# EAGLE design UI (EAGLE 9.6.2)

## Sheet 1 of 2
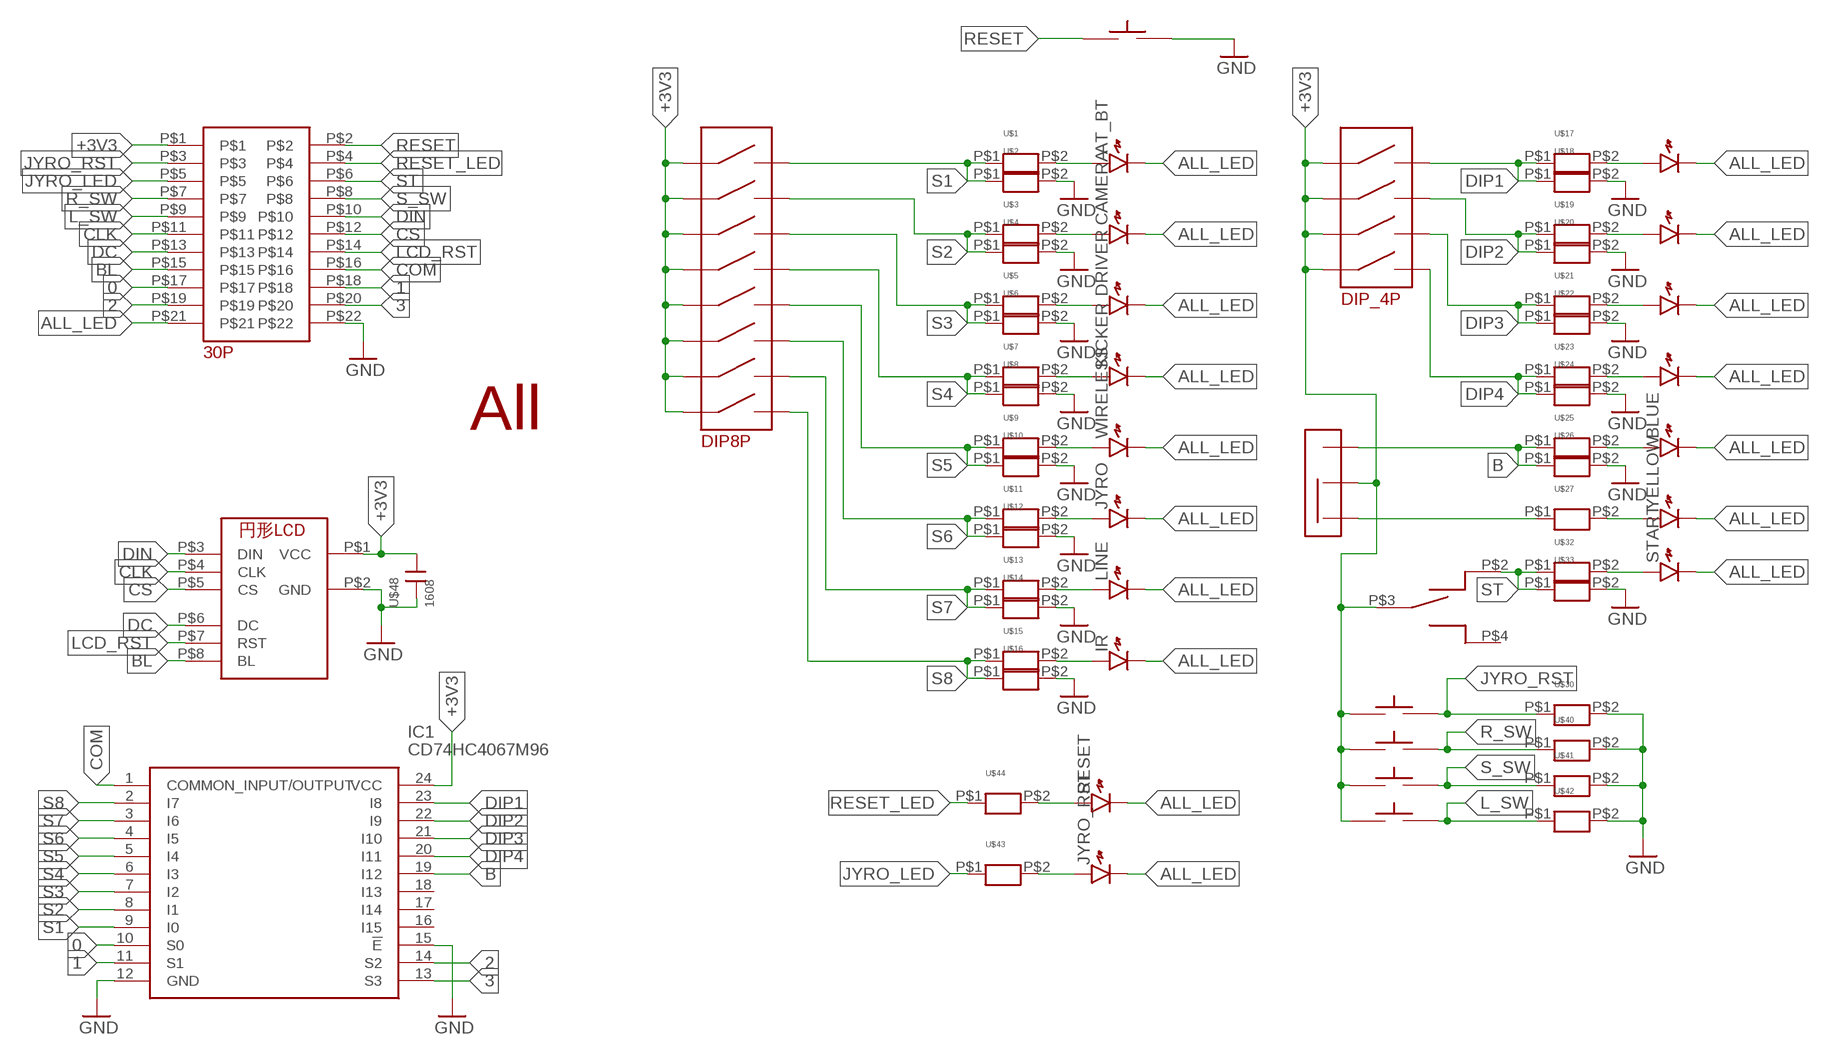
[diagram p0: schematic, sheet 1]

### Parts
AT_BT  LED1608  [LED1608]
BLUE  LED1608  [LED1608]
CAMERA  LED1608  [LED1608]
DRIVER  LED1608  [LED1608]
IC1  CD74HC4067M96  [SOIC127P1030X265-24N]
IR  LED1608  [LED1608]
JYRO  LED1608  [LED1608]
JYRO_RST  LED1608  [LED1608]
KICKER  LED1608  [LED1608]
LINE  LED1608  [LED1608]
RESET  LED1608  [LED1608]
START  LED1608  [LED1608]
U$1  R  [1608]
U$2  R  [1608]
U$3  R  [1608]
U$4  R  [1608]
U$5  R  [1608]
U$6  R  [1608]
U$7  R  [1608]
U$8  R  [1608]
U$9  R  [1608]
U$10  R  [1608]
U$11  R  [1608]
U$12  R  [1608]
U$13  R  [1608]
U$14  R  [1608]
U$15  R  [1608]
U$16  R  [1608]
U$17  R  [1608]
U$18  R  [1608]
U$19  R  [1608]
U$20  R  [1608]
U$21  R  [1608]
U$22  R  [1608]
U$23  R  [1608]
U$24  R  [1608]
U$25  R  [1608]
U$26  R  [1608]
U$27  R  [1608]
U$28  DIPSW4  [DIPSW4]
U$29  TAKUTO  [12]
U$30  R  [1608]
U$31  S  [S]
U$32  R  [1608]
U$33  R  [1608]
U$34  TAKUTO  [12]
U$35  SSW  [SSW]
U$36  DIPSW8  [DIPSW8]
U$37  TAKUTO  [12]
U$38  TAKUTO  [12]
U$39  TAKUTO  [12]
U$40  R  [1608]
U$41  R  [1608]
U$42  R  [1608]
U$43  R  [1608]
U$44  R  [1608]
U$45  LPRP  [LPRO]
U$46  LCDEN  [LCD]
U$48  1608  [CON]
U$49  ALL  [ALL]
WIRELESS  LED1608  [LED1608]
YELLOW  LED1608  [LED1608]
Ⅰ  LED1608  [LED1608]
Ⅱ  LED1608  [LED1608]
Ⅲ  LED1608  [LED1608]
Ⅳ  LED1608  [LED1608]

### Nets
0: IC1.10(S0) U$45.P$17
1: IC1.11(S1) U$45.P$18
2: IC1.14(S2) U$45.P$19
3: IC1.13(S3) U$45.P$20
+3V3: IC1.24(VCC) U$28.P$1 U$28.P$2 U$28.P$3 U$28.P$4 U$31.P$3 U$34.P$1 U$34.P$2 U$35.P$3 U$36.P$1 U$36.P$2 U$36.P$3 U$36.P$4 U$36.P$5 U$36.P$6 U$36.P$7 U$36.P$8 U$37.P$1 U$37.P$2 U$38.P$1 U$38.P$2 U$39.P$1 U$39.P$2 U$45.P$1 U$46.P$1(VCC) U$48.P$1
ALL_LED: AT_BT.K BLUE.K CAMERA.K DRIVER.K IR.K JYRO.K JYRO_RST.K KICKER.K LINE.K RESET.K START.K U$45.P$21 WIRELESS.K YELLOW.K Ⅰ.K Ⅱ.K Ⅲ.K Ⅳ.K
B: IC1.19(I12) U$25.P$1 U$26.P$1 U$35.P$2
BL: U$45.P$15 U$46.P$8(BL)
CLK: U$45.P$11 U$46.P$4(CLK)
COM: IC1.1(COMMON_INPUT/OUTPUT) U$45.P$16
CS: U$45.P$12 U$46.P$5(CS)
DC: U$45.P$13 U$46.P$6(DC)
DIN: U$45.P$10 U$46.P$3(DIN)
DIP1: IC1.23(I8) U$17.P$1 U$18.P$1 U$28.P$8
DIP2: IC1.22(I9) U$19.P$1 U$20.P$1 U$28.P$7
DIP3: IC1.21(I10) U$21.P$1 U$22.P$1 U$28.P$6
DIP4: IC1.20(I11) U$23.P$1 U$24.P$1 U$28.P$5
GND: IC1.12(GND) IC1.15(!E) U$2.P$2 U$4.P$2 U$6.P$2 U$8.P$2 U$10.P$2 U$12.P$2 U$14.P$2 U$16.P$2 U$18.P$2 U$20.P$2 U$22.P$2 U$24.P$2 U$26.P$2 U$29.P$3 U$29.P$4 U$30.P$2 U$33.P$2 U$40.P$2 U$41.P$2 U$42.P$2 U$45.P$22 U$46.P$2(GND) U$48.P$2
JYRO_LED: U$43.P$1 U$45.P$5
JYRO_RST: U$30.P$1 U$34.P$3 U$34.P$4 U$45.P$3
L_SW: U$39.P$3 U$39.P$4 U$42.P$1 U$45.P$9
LCD_RST: U$45.P$14 U$46.P$7(RST)
N$1: JYRO_RST.A U$43.P$2
N$2: START.A U$32.P$2
N$3: AT_BT.A U$1.P$2
N$4: CAMERA.A U$3.P$2
N$5: RESET.A U$44.P$2
N$6: DRIVER.A U$5.P$2
N$8: KICKER.A U$7.P$2
N$10: U$9.P$2 WIRELESS.A
N$12: JYRO.A U$11.P$2
N$14: LINE.A U$13.P$2
N$16: IR.A U$15.P$2
N$18: U$17.P$2 Ⅰ.A
N$20: U$19.P$2 Ⅱ.A
N$22: U$21.P$2 Ⅲ.A
N$24: U$23.P$2 Ⅳ.A
N$26: BLUE.A U$25.P$2
N$28: U$27.P$2 YELLOW.A
R_SW: U$37.P$3 U$37.P$4 U$40.P$1 U$45.P$7
RESET: U$29.P$1 U$29.P$2 U$45.P$2
RESET_LED: U$44.P$1 U$45.P$4
S1: IC1.9(I0) U$1.P$1 U$2.P$1 U$36.P$16
S2: IC1.8(I1) U$3.P$1 U$4.P$1 U$36.P$15
S3: IC1.7(I2) U$5.P$1 U$6.P$1 U$36.P$14
S4: IC1.6(I3) U$7.P$1 U$8.P$1 U$36.P$13
S5: IC1.5(I4) U$9.P$1 U$10.P$1 U$36.P$12
S6: IC1.4(I5) U$11.P$1 U$12.P$1 U$36.P$11
S7: IC1.3(I6) U$13.P$1 U$14.P$1 U$36.P$10
S8: IC1.2(I7) U$15.P$1 U$16.P$1 U$36.P$9
S_SW: U$38.P$3 U$38.P$4 U$41.P$1 U$45.P$8
ST: U$31.P$2 U$32.P$1 U$33.P$1 U$45.P$6
Y: U$27.P$1 U$35.P$1
Unconnected: IC1.16(I15) IC1.17(I14) IC1.18(I13) U$31.P$4

## Sheet 2 of 2
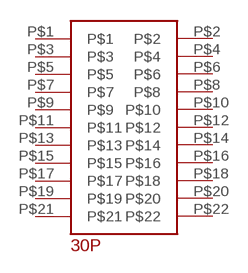
[diagram p1: schematic, sheet 2]

### Parts
U$47  LPRP  [LPRO]
Unconnected: U$47.P$1 U$47.P$2 U$47.P$3 U$47.P$4 U$47.P$5 U$47.P$6 U$47.P$7 U$47.P$8 U$47.P$9 U$47.P$10 U$47.P$11 U$47.P$12 U$47.P$13 U$47.P$14 U$47.P$15 U$47.P$16 U$47.P$17 U$47.P$18 U$47.P$19 U$47.P$20 U$47.P$21 U$47.P$22

## Library data of the parts
AT_BT BLUE CAMERA DRIVER IR JYRO JYRO_RST KICKER LINE RESET START WIRELESS YELLOW Ⅰ Ⅱ Ⅲ Ⅳ = generic:LED: Generic LEDs
IC1 = 16ch アナログマルチプレクサ:CD74HC4067M96: High Speed CMOS 16-Channel Analog Multiplexer/Demultiplexer Source: Datasheet <http://www.ti.com/lit/gpn/cd74hc4067>; DESCRIPTION: High Speed CMOS 16-Channel Analog Multiplexer/Demultiplexer; HEIGHT: 2.65mm; MANUFACTURER_NAME: Texas Instruments; MANUFACTURER_PART_NUMBER: CD74HC4067M96; MOUSER_PART_NUMBER: 595-CD74HC4067M96; MOUSER_PRICE-STOCK: https://www.mouser.co.uk/ProductDetail/Texas-Instruments/CD74HC4067M96?qs=xFfolx0DHx0XT7d9xTTZBA%3D%3D
U$1-U$27 U$30 U$32 U$33 U$40-U$44 = R 1608:R
U$28 = 4P_DIPSW:DIPSW4
U$29 U$34 U$37-U$39 = タクト:TAKUTO
U$31 = トグル:S
U$35 = SSW:SSW
U$36 = 8P_DIPSW:DIPSW8
U$45 U$47 = 22Ｐ　ロープロ:LPRP
U$46 = 円形LCD:LCDEN
U$48 = con1608:1608
U$49 = All_outlook:ALL

## Net classes
0 default: width 0.279 mm

## Board
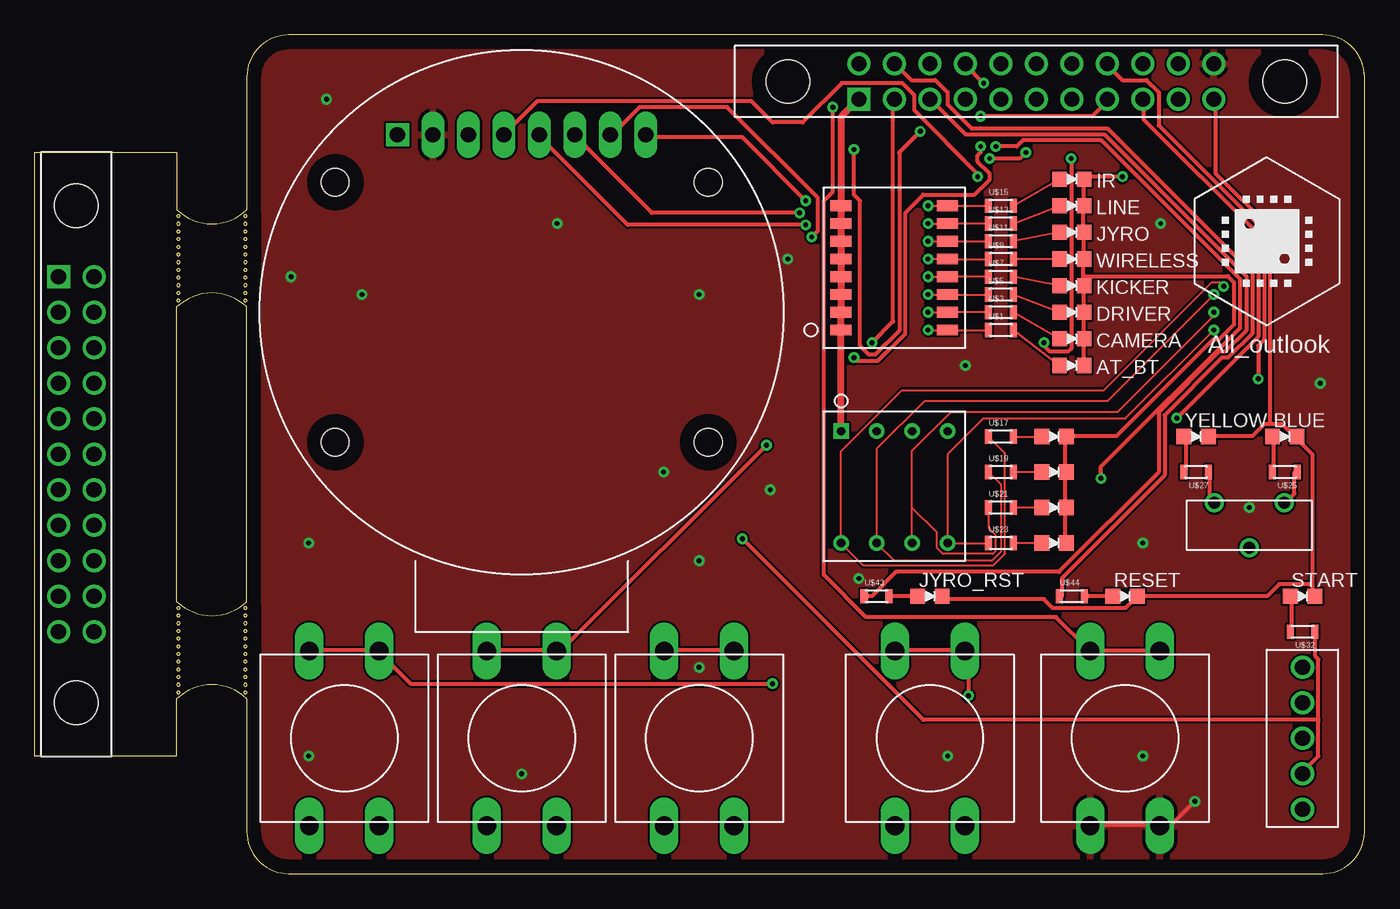
[diagram p2: board, top side]
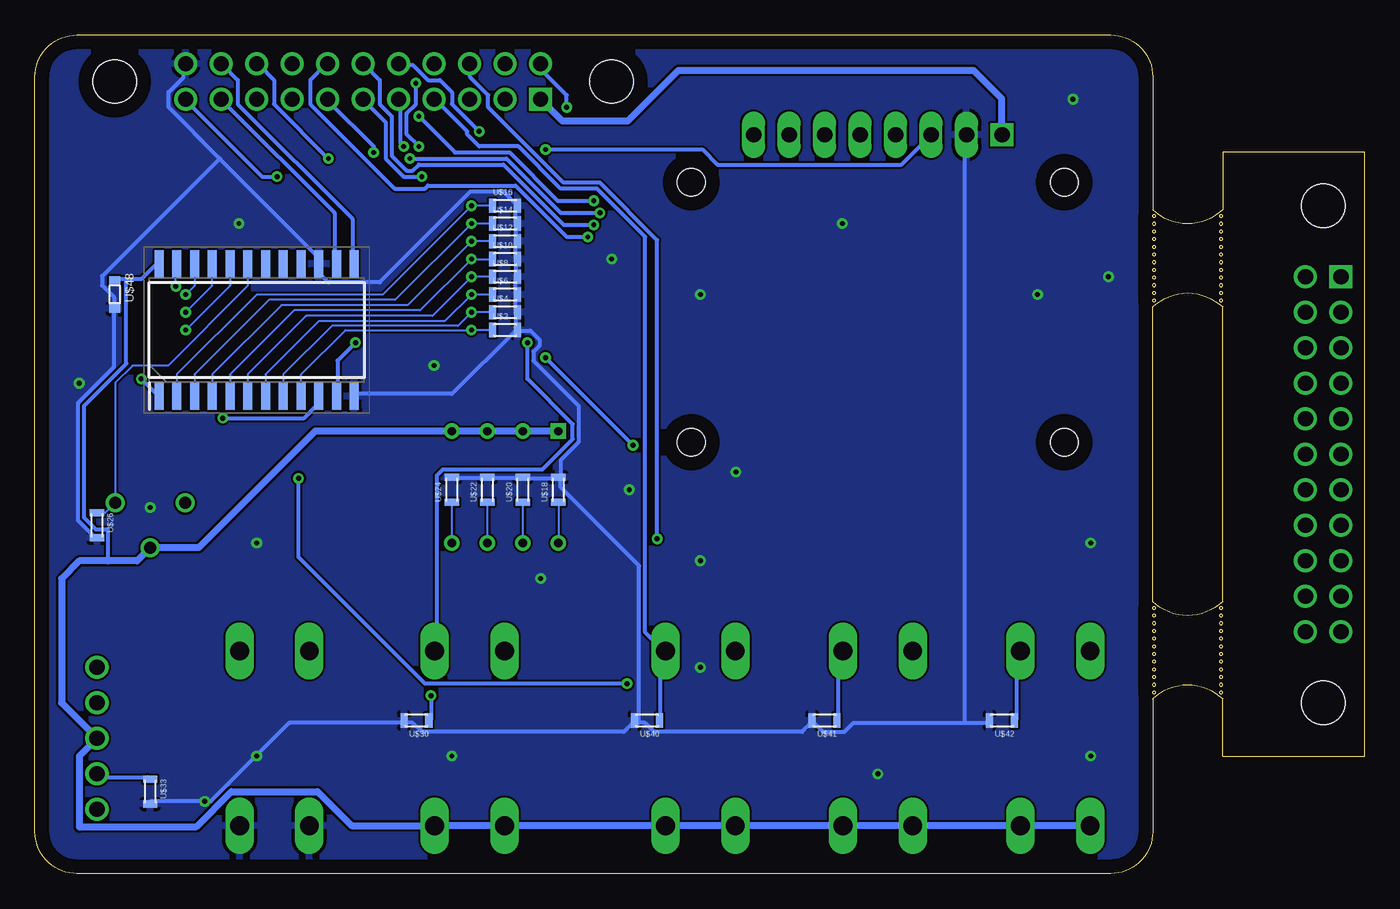
[diagram p3: board, bottom side, seen from below]

Size 95.16 x 60 mm. Coordinates in mm from the lower left corner, seen from the top.
Outline: 95.16,57 arc90 92.16,60
Outline: 18.16,60 arc90 15.16,57
Outline: 15.16,3 arc90 18.16,0
Outline: 92.16,0 arc90 95.16,3
Outline: 18.16,0 92.16,0
Outline: 92.16,0 arc90 95.16,3
Outline: 95.16,3 95.16,57
Outline: 92.16,60 18.16,60
Outline: 95.16,57 arc90 92.16,60
Outline: 18.16,60 arc90 15.16,57
Outline: 15.16,3 arc90 18.16,0
Outline: 15.16,3 15.16,12.51 arc87 10.16,12.51 10.16,8.41 0,8.41 0,51.59 10.16,51.59 10.16,47.49 arc87 15.16,47.49 15.16,57
Outline: 10.16,19.46 arc87 15.16,19.46 15.16,40.54 arc87 10.16,40.54 10.16,19.46
Outline: circle at 10.26,19.01 radius 0.1
Outline: circle at 10.26,18.46 radius 0.1
Outline: circle at 10.26,17.91 radius 0.1
Outline: circle at 10.26,17.36 radius 0.1
Outline: circle at 10.26,16.81 radius 0.1
Outline: circle at 10.26,16.26 radius 0.1
Outline: circle at 10.26,15.71 radius 0.1
Outline: circle at 10.26,15.16 radius 0.1
Outline: circle at 10.26,14.61 radius 0.1
Outline: circle at 10.26,14.06 radius 0.1
Outline: circle at 10.26,13.51 radius 0.1
Outline: circle at 10.26,12.96 radius 0.1
Outline: circle at 15.06,16.81 radius 0.1
Outline: circle at 15.06,18.46 radius 0.1
Outline: circle at 15.06,14.06 radius 0.1
Outline: circle at 15.06,12.96 radius 0.1
Outline: circle at 15.06,13.51 radius 0.1
Outline: circle at 15.06,19.01 radius 0.1
Outline: circle at 15.06,17.91 radius 0.1
Outline: circle at 15.06,15.71 radius 0.1
Copper layers (1*16): Top 0.035mm / dielectric 1.5mm / Bottom 0.035mm
Design rules "default": minimum track width 6mil, minimum drill 0.35mm, track to track 6mil, track to pad 6mil, pad to pad 6mil, via to via 6mil, smd to smd 6mil, copper to edge 40mil, drill to drill 6mil, minimum pad ring 10mil, minimum via ring 8mil, stop-mask expansion 4mil, vias tented up to drill 0mil, thermal gap 10mil

### Footprints (pad centres in the part's own frame; a part is rotated, then mirrored left to right if it is on the bottom)
LED1608 = smd 1.05 x 1.08: A -0.875,0; K 0.875,0
SOIC127P1030X265-24N = smd 1.95 x 0.65: 1 -4.725,6.985; 2 -4.725,5.715; 3 -4.725,4.445; 4 -4.725,3.175; 5 -4.725,1.905; 6 -4.725,0.635; 7 -4.725,-0.635; 8 -4.725,-1.905; 9 -4.725,-3.175; 10 -4.725,-4.445; 11 -4.725,-5.715; 12 -4.725,-6.985; 13 4.725,-6.985; 14 4.725,-5.715; 15 4.725,-4.445; 16 4.725,-3.175; 17 4.725,-1.905; 18 4.725,-0.635; 19 4.725,0.635; 20 4.725,1.905; 21 4.725,3.175; 22 4.725,4.445; 23 4.725,5.715; 24 4.725,6.985
1608 = smd 0.508 x 1.016: P$1 -0.889,0; P$2 0.889,0
DIPSW4 = drill 0.6 square: P$1 0,8 | drill 0.6: P$2 2.54,8; P$3 5.08,8; P$4 7.62,8; P$5 7.62,0; P$6 5.08,0; P$7 2.54,0; P$8 0,0
12 = drill 1.35 long: P$1 -6.25,2.5; P$2 -6.25,-2.5; P$3 6.25,-2.5; P$4 6.25,2.5
S = drill 1.1: P$1 0,-5.08; P$2 0,-2.54; P$3 0,0; P$4 0,2.54; P$5 0,5.08
SSW = drill 0.85: P$1 -2.5,1.6; P$2 2.5,1.6; P$3 0,-1.6
DIPSW8 = smd 0.76 x 1.5: P$1 0,7.62; P$2 1.27,7.62; P$3 2.54,7.62; P$4 3.81,7.62; P$5 5.08,7.62; P$6 6.35,7.62; P$7 7.62,7.62; P$8 8.89,7.62; P$9 8.89,0; P$10 7.62,0; P$11 6.35,0; P$12 5.08,0; P$13 3.81,0; P$14 2.54,0; P$15 1.27,0; P$16 0,0
LPRO = drill 1.1 square: P$1 0,29.21 | drill 1.1: P$2 2.54,29.21; P$3 0,26.67; P$4 2.54,26.67; P$5 0,24.13; P$6 2.54,24.13; P$7 0,21.59; P$8 2.54,21.59; P$9 0,19.05; P$10 2.54,19.05; P$11 0,16.51; P$12 2.54,16.51; P$13 0,13.97; P$14 2.54,13.97; P$15 0,11.43; P$16 2.54,11.43; P$17 0,8.89; P$18 2.54,8.89; P$19 0,6.35; P$20 2.54,6.35; P$21 0,3.81; P$22 2.54,3.81 | hole 3.1: 1.27,-1.27; 1.27,34.29
LCD = drill 1.1 square: P$1 -8.89,12.7 | drill 1.1 long: P$2 -6.35,12.7; P$3 -3.81,12.7; P$4 -1.27,12.7; P$5 1.27,12.7; P$6 3.81,12.7; P$7 6.35,12.7; P$8 8.89,12.7 | hole 2: -13.35,9.3; 13.35,9.3; 13.35,-9.3; -13.35,-9.3
CON = smd 0.6 x 0.813: P$1 -1,0; P$2 1,0

### Placement (x,y rotation side)
AT_BT  74.21,36.35 0 top
BLUE  89.45,31.27 0 top
CAMERA  74.21,38.26 0 top
DRIVER  74.21,40.16 0 top
IC1  79.29,38.89 90 bottom
IR  74.21,49.69 0 top
JYRO  74.21,45.88 0 top
JYRO_RST  64.05,19.84 0 top
KICKER  74.21,42.06 0 top
LINE  74.21,47.78 0 top
RESET  78.02,19.84 0 top
START  90.72,19.84 0 top
U$1  69.13,38.89 0 top
U$2  61.51,38.89 0 bottom
U$3  69.13,40.16 0 top
U$4  61.51,40.16 0 bottom
U$5  69.13,41.43 0 top
U$6  61.51,41.43 0 bottom
U$7  69.13,42.7 0 top
U$8  61.51,42.7 0 bottom
U$9  69.13,43.97 0 top
U$10  61.51,43.97 0 bottom
U$11  69.13,45.24 0 top
U$12  61.51,45.24 0 bottom
U$13  69.13,46.51 0 top
U$14  61.51,46.51 0 bottom
U$15  69.13,47.78 0 top
U$16  61.51,47.78 0 bottom
U$17  69.13,31.27 0 top
U$18  57.7,27.46 90 bottom
U$19  69.13,28.73 0 top
U$20  60.24,27.46 90 bottom
U$21  69.13,26.19 0 top
U$22  62.78,27.46 90 bottom
U$23  69.13,23.65 0 top
U$24  65.32,27.46 90 bottom
U$25  89.45,28.73 180 top
U$26  90.72,24.92 270 bottom
U$27  83.1,28.73 180 top
U$28  57.7,23.65 0 top
U$29  78.02,9.68 270 top
U$30  67.86,10.95 180 bottom
U$31  90.72,9.68 0 top
U$32  90.72,17.3 180 top
U$33  86.91,5.87 270 bottom
U$34  64.05,9.68 90 top
U$35  86.91,24.92 0 top
U$36  65.32,38.89 90 top
U$37  47.54,9.68 90 top
U$38  34.84,9.68 90 top
U$39  22.14,9.68 90 top
U$40  51.35,10.95 180 bottom
U$41  38.65,10.95 180 bottom
U$42  25.95,10.95 180 bottom
U$43  60.24,19.84 0 top
U$44  74.21,19.84 0 top
U$45  88.18,55.4 90 top
U$46  34.84,40.16 0 top
U$47  1.69,13.49 0 top
U$48  89.45,41.43 270 bottom
U$49  88.18,45.24 0 top
WIRELESS  74.21,43.97 0 top
YELLOW  83.1,31.27 0 top
Ⅰ  72.94,31.27 0 top
Ⅱ  72.94,28.73 0 top
Ⅲ  72.94,26.19 0 top
Ⅳ  72.94,23.65 0 top

### Tracks (layer width: path | path; a pad name or v marks a point on that pad's centre or on a via)
0  (via drill 0.35)
  Top 0.279: v81.72,32.59 87.54,38.42 87.54,45.76 79.34,53.97 79.34,55.26 U$45.P$17
  Bottom 0.279: v81.72,32.59 75.89,32.59 75.02,33.45 75.02,34.1 IC1.10
1  (via drill 0.35)
  Top 0.279: v72.22,37.99 72.22,37.77 72.65,37.34 73.94,37.34 74.16,37.56 v74.16,51.16
  Bottom 0.279: v72.22,37.99 73.51,36.69 73.51,34.32 IC1.11 | v74.16,51.16 78.05,55.04 78.05,56.77 79.12,57.85 U$45.P$18
2
  Bottom 0.279: IC1.14 73.73,43.82 73.73,47.27 81.72,55.26 U$45.P$19
3
  Bottom 0.279: IC1.13 72.43,43.82 72.43,46.84 80.64,55.04 80.64,56.77 81.72,57.85 U$45.P$20
+3V3
  Top 0.508: U$28.P$1 U$36.P$1 U$36.P$2 U$36.P$3 U$36.P$4 U$36.P$5 U$36.P$6 U$36.P$7 U$36.P$8 57.7,54.13 U$45.P$1
  Bottom 0.279: 88.62,42.52 87.54,42.52 86.47,43.6 IC1.24 | 88.62,42.52 89.27,42.52 U$48.P$1 | 88.62,42.52 88.62,36.48 91.65,33.45 91.65,25.47 90.78,24.6 89.92,24.6 89.92,22.38
  Bottom 0.508: U$28.P$1 U$28.P$2 U$28.P$3 U$28.P$4 75.1,31.65 83.43,23.32 U$35.P$3 87.85,22.38 89.92,22.38 91.99,22.38 93.26,21.11 93.26,12.22 U$31.P$3 91.99,8.41 91.99,3.33 91.95,3.37 83.6,3.37 81.11,5.86 74.93,5.86 72.5,3.43 U$34.P$2 U$34.P$1 U$37.P$2 U$37.P$1 U$38.P$2 U$38.P$1 U$39.P$2 U$39.P$1 | U$45.P$1 57.42,53.85 52.72,53.85 49.12,57.46 27.98,57.46 25.99,55.47 25.99,52.9 U$46.P$1
ALL_LED  (via drill 0.35)
  Top 0.279: Ⅳ.K 73.73,23.74 73.73,26.11 Ⅲ.K 73.73,26.33 73.73,28.7 Ⅱ.K 73.73,28.92 73.73,31.08 Ⅰ.K 73.94,31.3 77.4,31.3 84.31,38.2 84.74,38.2 85.82,39.28 85.82,42.31 85.39,42.74 75.02,42.74 | AT_BT.K 75.02,36.48 75.02,38.2 CAMERA.K 75.02,38.42 75.02,40.15 DRIVER.K 75.02,40.36 75.02,41.87 KICKER.K 75.02,42.09 75.02,42.74 | 75.02,42.74 75.02,43.82 WIRELESS.K 75.02,44.03 75.02,45.76 JYRO.K 75.02,45.98 75.02,47.7 LINE.K 75.02,47.92 75.02,49.65 IR.K 75.24,49.86 v77.83,49.86 | JYRO_RST.K 65.09,19.64 72.22,19.64 72.86,18.99 78.05,18.99 78.69,19.64 RESET.K 78.91,19.85 88.19,19.85 89.06,20.72 91.43,20.72 | 88.41,32.16 89.27,32.16 90.14,31.3 BLUE.K 90.35,31.08 91.43,30 91.43,20.72 | 88.41,32.16 87.98,32.16 87.11,31.3 84.09,31.3 YELLOW.K | 91.43,20.72 91.43,19.85 START.K | 88.41,32.16 88.41,46.19 84.52,50.08 84.52,55.26 U$45.P$21
  Bottom 0.279: v77.83,49.86 78.91,49.86 84.31,55.26 U$45.P$21
B
  Top 0.279: U$25.P$1 90.14,28.7 90.14,27.19 89.49,26.55 U$35.P$2
  Bottom 0.152: IC1.19 79.92,42.06 85.64,36.35 88.18,36.35 89.41,35.12 U$35.P$2 90.12,25.81 U$26.P$1
BL  (via drill 0.35)
  Top 0.279: v55.16,48.14 50.63,52.67 43.93,52.67 U$46.P$8 | v67.68,54.18 75.67,54.18 76.75,55.26 U$45.P$15
  Bottom 0.279: v55.16,48.14 57.75,48.14 61.2,51.59 65.09,51.59 v67.68,54.18
CLK  (via drill 0.35)
  Top 0.279: v67.47,49.86 67.47,50.08 62.93,54.61 62.93,55.69 62.07,56.56 57.75,56.56 54.94,53.75 52.78,53.75 51.27,55.26 35.94,55.26 33.57,52.89 U$46.P$4
  Bottom 0.279: v67.47,49.86 68.76,49.86 70.06,51.16 70.06,53.75 71.57,55.26 U$45.P$11
COM  (via drill 0.35)
  Top 0.279: v87.54,35.4 87.54,37.77 87.98,38.2 87.98,45.98 80.42,53.53 80.42,55.91 79.56,56.77 77.83,56.77 76.75,57.85 U$45.P$16
  Bottom 0.279: v87.54,35.4 86.47,34.32 IC1.1
CS  (via drill 0.35)
  Top 0.279: v55.16,46.41 42.42,46.41 36.16,52.67 U$46.P$5
  Bottom 0.279: v55.16,46.41 57.32,46.41 61.64,50.73 67.68,50.73 68.11,50.3 68.55,50.3 69.62,51.37 69.62,54.18 70.49,55.04 70.49,56.77 71.57,57.85 U$45.P$12
DC  (via drill 0.35)
  Top 0.279: v54.73,47.27 44.15,47.27 38.75,52.67 U$46.P$6 | v68.33,51.16 70.49,51.16 v70.92,51.59
  Bottom 0.279: v54.73,47.27 57.53,47.27 61.42,51.16 v68.33,51.16 | v70.92,51.59 70.92,52.02 74.16,55.26 U$45.P$13
DIN  (via drill 0.35)
  Top 0.279: v58.61,51.81 58.61,48.57 59.05,48.14 59.05,37.77 59.69,37.12 60.13,37.12 61.85,38.85 61.85,51.59 v63.36,53.1
  Bottom 0.279: v58.61,51.81 47.39,51.81 46.31,50.73 33.14,50.73 31.19,52.67 U$46.P$3 | v63.36,53.1 65.31,55.04 65.31,55.91 66.17,56.77 67.03,56.77 68.11,57.85 68.98,57.85 U$45.P$10
DIP1  (via drill 0.35)
  Top 0.152: v85.08,42.01 84.77,42.32 84.24,42.32 76.5,34.57 62.05,34.57 57.7,30.22 U$28.P$8 59.27,22.07 68.61,22.07 69.44,22.9 69.44,30.08 U$17.P$1
  Bottom 0.152: v85.08,42.01 85.08,43.54 IC1.23 | U$18.P$1 U$28.P$8
DIP2  (via drill 0.35)
  Top 0.152: v84.37,41.43 76.75,33.81 63.67,33.81 60.24,30.38 U$28.P$7 61.51,22.38 68.49,22.38 69.13,23.02 69.13,27.84 U$19.P$1
  Bottom 0.152: IC1.22 83.73,42.06 v84.37,41.43 | U$28.P$7 U$20.P$1
DIP3  (via drill 0.35)
  Top 0.152: v84.37,40.16 84.37,39.91 77.51,33.05 65.57,33.05 62.78,30.25 62.78,26.19 | U$28.P$6 62.78,26.19 | 62.78,26.19 64.54,24.43 64.54,23.33 65,22.87 68.54,22.87 68.72,23.05 68.72,24.25 68.24,24.73 U$21.P$1
  Bottom 0.152: v84.37,40.16 82.47,42.06 IC1.21 | U$28.P$6 U$22.P$1
DIP4  (via drill 0.35)
  Top 0.152: v84.37,38.89 78.02,32.54 67.86,32.54 65.32,30 U$28.P$5 U$23.P$1
  Bottom 0.152: IC1.20 81.19,42.06 v84.37,38.89 | U$28.P$5 U$24.P$1
GND  (via drill 0.35)
  Top 0.279: U$29.P$3 75.67,3.44 80.42,3.44 U$29.P$4 80.64,3.44 81.28,3.44 v83.01,5.17
  Bottom 0.279: U$26.P$2 90.78,23.95 92.08,25.25 92.08,33.67 89.49,36.26 89.49,40.36 U$48.P$2 89.49,40.58 89.49,41.23 90.35,42.09 90.35,42.74 81.93,51.16 | U$18.P$2 57.75,28.27 60.13,28.27 U$20.P$2 60.34,28.27 62.72,28.27 U$22.P$2 62.93,28.27 65.31,28.27 U$24.P$2 | U$2.P$2 60.77,39.07 60.77,40.15 U$4.P$2 60.77,40.36 60.77,41.23 U$6.P$2 60.77,41.44 60.77,42.52 U$8.P$2 60.77,42.74 60.77,43.82 U$10.P$2 60.77,44.03 60.77,45.11 U$12.P$2 60.77,45.33 60.77,46.41 U$14.P$2 60.77,46.62 60.77,47.7 U$16.P$2 60.77,47.92 61.64,48.78 64.01,48.78 70.49,42.31 74.16,42.31 74.81,42.95 74.81,43.6 IC1.15 75.02,43.82 75.02,44.25 81.93,51.16 | IC1.12 72.22,34.32 65.31,34.32 60.77,38.85 U$2.P$2 | 81.93,51.16 85.6,54.83 85.6,55.91 84.52,56.99 84.52,57.85 U$45.P$22 | U$18.P$2 57.53,28.49 57.53,29.57 56.24,30.86 56.24,33.45 59.48,36.69 59.48,37.34 59.05,37.77 59.05,38.2 59.69,38.85 60.56,38.85 U$2.P$2 | 28.6,10.79 36.59,10.79 37.24,10.14 38.75,10.14 39.4,10.79 U$41.P$2 39.61,10.79 40.26,10.14 50.84,10.14 51.49,10.79 51.92,10.79 | 28.6,10.79 26.88,10.79 U$42.P$2 | 51.92,10.79 52.14,10.79 U$40.P$2 52.35,10.79 53,10.14 67.47,10.14 68.11,10.79 68.55,10.79 U$30.P$2 68.76,10.79 76.97,10.79 82.58,5.17 v83.01,5.17 86.9,5.17 U$33.P$2 | 28.6,10.79 28.6,52.67 U$46.P$2 | 51.92,10.79 51.92,22.01 57.53,27.62 57.53,28.27 U$18.P$2
  other vias: 66.59,36.35 79.29,23.65 58.97,21.11 52.62,27.46 45,28.73 47.54,22.38 47.54,14.76 65.32,8.41 79.29,8.41 86.91,26.19 91.99,35.08 80.56,46.51 47.54,41.43 53.89,43.97 37.38,46.51 23.41,41.43 20.87,55.4 18.33,42.7 19.6,23.65 19.6,8.41 34.84,7.14
  pour Bottom: 11.98,61.75 11.98,-3.02 99.61,-3.02 99.61,61.75
  pour Top: 11.98,61.75 11.98,-3.02 99.61,-3.02 99.61,61.75
JYRO_LED
  Top 0.279: U$43.P$1 59.48,19.85 59.91,19.85 61.64,21.58 73.3,21.58 80.42,28.7 80.42,33.02 84.74,37.34 85.17,37.34 86.68,38.85 86.68,42.74 76.53,52.89 66.6,52.89 64.23,55.26 U$45.P$5
JYRO_RST  (via drill 0.35)
  Top 0.279: v66.82,12.73 66.82,15.54 66.6,15.75 U$34.P$3 66.39,15.97 61.64,15.97 U$34.P$4 | v59.91,37.99 61.42,39.5 61.42,55.26 U$45.P$3
  Bottom 0.279: v66.82,12.73 66.82,11 U$30.P$1 | v59.91,37.99 59.91,35.4 56.67,32.16 56.67,31.08 58.83,28.92 65.95,28.92 66.39,28.49 66.39,15.97 U$34.P$3
L_SW  (via drill 0.35)
  Top 0.279: v68.76,52.02 70.27,52.02 70.7,52.45 76.32,52.45 86.25,42.52 86.25,39.07 76.29,29.11 v76.29,28.27 | v52.78,13.59 26.88,13.59 24.72,15.75 U$39.P$3 24.5,15.97 19.75,15.97 U$39.P$4
  Bottom 0.279: U$42.P$1 24.93,11 24.93,15.54 24.72,15.75 U$39.P$3 | v68.76,52.02 68.98,52.24 68.98,55.26 U$45.P$9 | v76.29,28.27 76.29,22.63 67.25,13.59 v52.78,13.59
LCD_RST  (via drill 0.35)
  Top 0.279: v55.59,45.55 56.02,45.98 56.02,48.35 49.55,54.83 43.29,54.83 41.34,52.89 U$46.P$7
  Bottom 0.279: v55.59,45.55 57.1,45.55 60.77,49.22 67.03,49.22 67.25,49 69.41,49 75.45,55.04 75.45,56.77 74.38,57.85 U$45.P$14
N$1
  Top 0.279: U$43.P$2 61.2,19.85 63.15,19.85 JYRO_RST.A
N$2
  Top 0.279: U$32.P$2 89.92,17.48 89.92,19.64 START.A
N$3
  Top 0.152: AT_BT.A U$1.P$2
N$4
  Top 0.152: CAMERA.A U$3.P$2
N$5
  Top 0.279: U$44.P$2 75.24,19.85 76.97,19.85 RESET.A
N$6
  Top 0.152: DRIVER.A U$5.P$2
N$8
  Top 0.152: KICKER.A U$7.P$2
N$10
  Top 0.152: WIRELESS.A U$9.P$2
N$12
  Top 0.152: JYRO.A U$11.P$2
N$14
  Top 0.152: U$13.P$2 LINE.A
N$16
  Top 0.152: U$15.P$2 IR.A
N$18
  Top 0.152: U$17.P$2 Ⅰ.A
N$20
  Top 0.152: Ⅱ.A U$19.P$2
N$22
  Top 0.152: Ⅲ.A U$21.P$2
N$24
  Top 0.152: Ⅳ.A U$23.P$2
N$26
  Top 0.279: U$25.P$2 88.62,28.92 88.62,31.08 BLUE.A
N$28
  Top 0.279: U$27.P$2 82.36,28.92 82.36,31.08 YELLOW.A
R_SW
  Top 0.279: U$37.P$4 45.23,15.97 49.98,15.97 U$37.P$3
  Bottom 0.279: U$40.P$1 50.41,11 50.41,15.54 50.19,15.75 U$37.P$3 50.19,15.97 51.49,17.26 51.49,45.55 54.94,49 57.53,49 60.56,52.02 63.36,52.02 64.23,52.89 64.23,53.1 66.39,55.26 U$45.P$7
RESET  (via drill 0.35)
  Top 0.279: v57.1,54.83 57.1,48.78 56.45,48.14 56.45,21.36 59.48,18.34 73.08,18.34 75.45,15.97 U$29.P$2 75.67,15.97 80.42,15.97 U$29.P$1
  Bottom 0.279: v57.1,54.83 57.1,55.69 58.83,57.42 58.83,57.85 U$45.P$2
RESET_LED
  Top 0.279: U$44.P$1 73.51,19.85 73.51,21.15 80.85,28.49 80.85,32.81 84.95,36.91 85.39,36.91 87.11,38.64 87.11,42.95 76.75,53.32 67.03,53.32 65.31,55.04 65.31,55.91 64.44,56.77 62.72,56.77 61.64,57.85 U$45.P$4
S1  (via drill 0.35)
  Top 0.152: v63.92,38.89 U$36.P$16 U$1.P$1
  Bottom 0.152: U$2.P$1 v63.92,38.89 72.94,38.89 76.11,35.72 IC1.9
S2  (via drill 0.35)
  Top 0.152: v63.92,40.16 U$36.P$15 U$3.P$1
  Bottom 0.152: U$4.P$1 v63.92,40.16 64.89,39.2 73.91,39.2 77.38,35.72 IC1.8
S3  (via drill 0.35)
  Top 0.152: v63.92,41.43 U$36.P$14 U$5.P$1
  Bottom 0.152: U$6.P$1 v63.92,41.43 65.83,39.52 74.84,39.52 78.66,35.72 IC1.7
S4  (via drill 0.35)
  Top 0.152: v63.92,42.7 U$36.P$13 U$7.P$1
  Bottom 0.152: U$8.P$1 v63.92,42.7 66.72,39.91 75.73,39.91 79.92,35.72 IC1.6
S5  (via drill 0.35)
  Top 0.152: v63.92,43.97 U$36.P$12 U$9.P$1
  Bottom 0.152: U$10.P$1 v63.92,43.97 67.61,40.29 76.62,40.29 81.19,35.72 IC1.5
S6  (via drill 0.35)
  Top 0.152: U$11.P$1 U$36.P$11 v63.92,45.24
  Bottom 0.152: U$12.P$1 v63.92,45.24 68.5,40.67 77.51,40.67 82.47,35.72 IC1.4
S7  (via drill 0.35)
  Top 0.152: U$13.P$1 U$36.P$10 v63.92,46.51
  Bottom 0.152: U$14.P$1 v63.92,46.51 69.38,41.05 78.4,41.05 83.73,35.72 IC1.3
S8  (via drill 0.35)
  Top 0.152: U$15.P$1 U$36.P$9 v63.92,47.78
  Bottom 0.152: U$16.P$1 v63.92,47.78 70.27,41.43 79.29,41.43 85,35.72 IC1.2
S_SW  (via drill 0.35)
  Top 0.279: v67.9,56.56 66.6,57.85 U$45.P$8 | v67.68,52.02 67.68,51.59 67.47,51.37 67.47,50.94 68.33,50.08 68.33,49.65 67.25,48.57 63.58,48.57 62.28,47.27 62.28,38.64 60.34,36.69 58.83,36.69 v58.61,36.91 | v52.35,30.65 37.46,15.75 U$38.P$3 37.24,15.97 32.49,15.97 U$38.P$4
  Bottom 0.279: U$41.P$1 37.67,11 37.67,15.54 37.46,15.75 U$38.P$3 | v67.9,56.56 67.9,55.04 68.55,54.4 68.55,52.89 v67.68,52.02 | v52.35,30.65 v58.61,36.91
ST  (via drill 0.35)
  Top 0.279: 91.86,11 91.86,8.41 90.78,7.33 U$31.P$2 | 91.86,11 91.86,15.32 91.65,15.54 91.65,17.26 U$32.P$1 | v50.63,23.95 63.58,11 91.86,11
  Bottom 0.279: U$33.P$1 87.11,6.9 90.35,6.9 90.57,7.11 U$31.P$2 | v50.63,23.95 50.63,45.33 54.73,49.43 57.32,49.43 62.72,54.83 62.72,55.69 64.01,56.99 64.01,57.85 U$45.P$6
Y
  Top 0.279: U$27.P$1 84.09,28.7 84.09,26.76 84.31,26.55 U$35.P$1